# EAGLE design main (EAGLE 7.6.0)
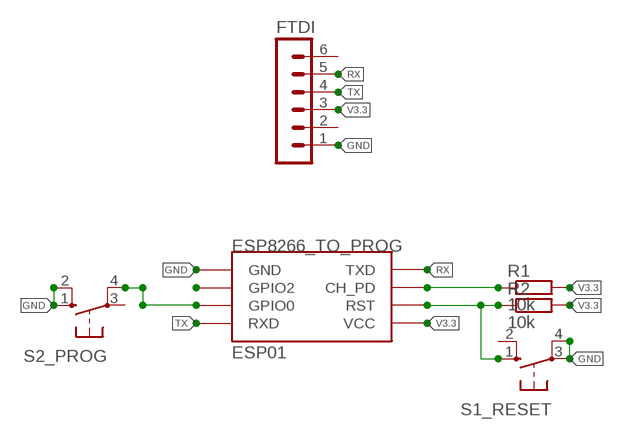
[diagram p0: schematic, sheet 1]

## Parts
ESP8266_TO_PROG  ESP01  [ESP01]
FTDI  MA06-1  [MA06-1]
R1  10k  R-EU_0204/7  [0204/7]
R2  10k  R-EU_0204/7  [0204/7]
S1_RESET  10-XX  [B3F-10XX]
S2_PROG  10-XX  [B3F-10XX]

## Nets
GND: ESP8266_TO_PROG.GND FTDI.1 S1_RESET.3(P) S1_RESET.4(P1) S2_PROG.1(S) S2_PROG.2(S1)
N$2: ESP8266_TO_PROG.GPIO2
N$3: ESP8266_TO_PROG.GPIO0 S2_PROG.4(P1)
N$6: ESP8266_TO_PROG.CH_PD R1.1
N$7: ESP8266_TO_PROG.RST R2.1 S1_RESET.1(S)
RX: ESP8266_TO_PROG.TX(TXD) FTDI.5
TX: ESP8266_TO_PROG.RX(RXD) FTDI.4
V3.3: ESP8266_TO_PROG.VCC FTDI.3 R1.2 R2.2
Unconnected: FTDI.2 FTDI.6 S1_RESET.2(S1) S2_PROG.3(P)

## Library data of the parts
ESP8266_TO_PROG = esp8266modules:ESP01: ESP8266 Wifi module 01
FTDI = con-lstb:MA06-1: PIN HEADER; OC_FARNELL: unknown; OC_NEWARK: unknown
R1 R2 = resistor:R-EU_: RESISTOR, European symbol
S1_RESET S2_PROG = switch-omron:10-XX: OMRON SWITCH; MPN: B3F-1000; OC_FARNELL: 176432; OC_NEWARK: 36M3542

## Board
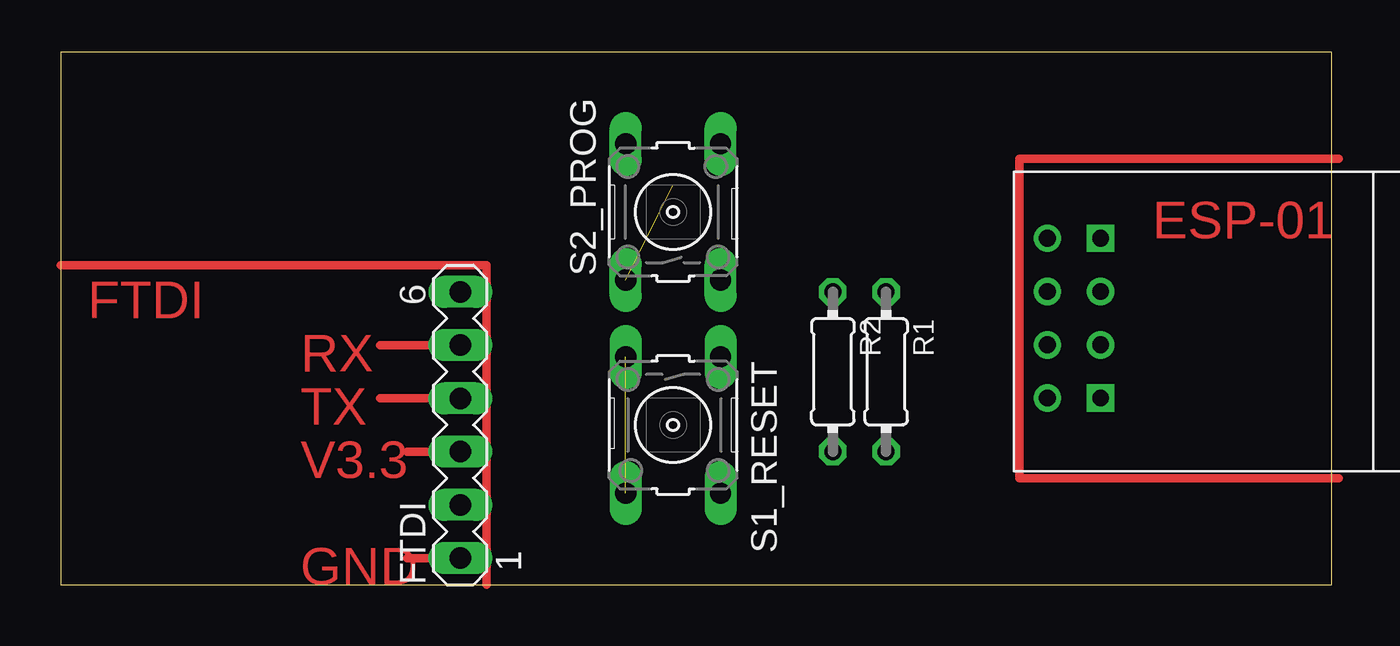
[diagram p1: board, top side]
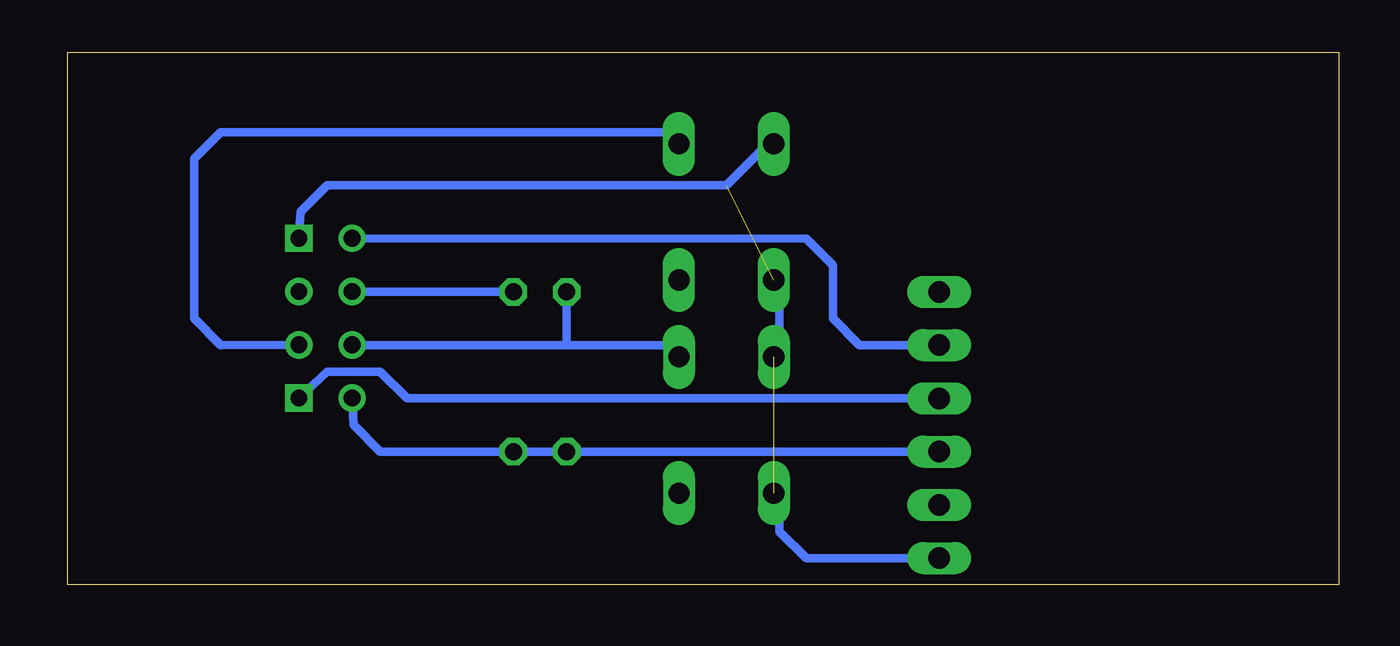
[diagram p2: board, bottom side, seen from below]

Size 60.63 x 25.39 mm. Coordinates in mm from the lower left corner, seen from the top.
Outline: 0,0 60.63,0 60.63,25.39 0,25.39 0,0
Copper layers (1*16): Top 0.035mm / dielectric 1.5mm / Bottom 0.035mm
Design rules "default": minimum track width 10mil, minimum drill 24mil, track to track 8mil, track to pad 8mil, pad to pad 8mil, via to via 8mil, smd to smd 8mil, copper to edge 40mil, drill to drill 8mil, minimum pad ring 10mil, minimum via ring 8mil, stop-mask expansion 4mil, vias tented up to drill 0mil, thermal gap 10mil

### Footprints (pad centres in the part's own frame; a part is rotated, then mirrored left to right if it is on the bottom)
ESP01 = drill 0.8: CH_PD -1.285,-8.178; GPIO0 1.255,-5.638; GPIO2 -1.285,-5.638; RST 1.255,-8.178; TX -3.825,-8.178; VCC 3.795,-8.178 | drill 0.8 square: GND -3.825,-5.638; RX 3.795,-5.638
MA06-1 = drill 1.016 long: 1 -6.35,0; 2 -3.81,0; 3 -1.27,0; 4 1.27,0; 5 3.81,0; 6 6.35,0
0204/7 = drill 0.813 octagon: 1 -3.81,0; 2 3.81,0
B3F-10XX = drill 1.016 long: 1 -3.251,2.261; 2 3.251,2.261; 3 -3.251,-2.261; 4 3.251,-2.261

### Placement (x,y rotation side)
ESP8266_TO_PROG  55.24,12.7 270 top
FTDI  19.05,7.62 90 top
R1  39.37,10.16 270 top
R2  36.83,10.16 270 top
S1_RESET  29.21,7.62 270 top
S2_PROG  29.21,17.78 90 top

### Tracks (layer width: path | path; a pad name or v marks a point on that pad's centre or on a via)
GND  (2 unrouted)
  Bottom 0.406: S2_PROG.2 26.67,21.59 29.21,19.05 48.26,19.05 49.53,17.78 ESP8266_TO_PROG.GND | S1_RESET.3 26.67,11.43 26.67,13.97 S2_PROG.1 | FTDI.1 25.4,1.27 26.67,2.54 26.67,5.08 S1_RESET.4
N$1
  Top 0.406: 0,15.24 20.32,15.24 20.32,0
N$3
  Bottom 0.406: S2_PROG.4 31.47,21.31 31.75,21.59 53.34,21.59 54.61,20.32 54.61,12.7 53.34,11.43 ESP8266_TO_PROG.GPIO0 49.62,11.43
N$4
  Top 0.406: 15.24,11.43 17.78,11.43
N$5
  Top 0.406: 15.24,8.89 17.78,8.89
N$6
  Bottom 0.406: R1.1 47.05,13.97 ESP8266_TO_PROG.CH_PD
N$7
  Bottom 0.406: R2.1 36.83,11.43 | 36.83,11.43 31.75,11.43 31.75,11.15 S1_RESET.1 | 36.83,11.43 47.05,11.43 ESP8266_TO_PROG.RST
N$8
  Top 0.406: 16.51,6.35 17.78,6.35
N$9
  Top 0.406: 17.78,1.27 16.51,1.27
N$10
  Top 0.406: 60.96,20.32 45.72,20.32 45.72,5.08 60.96,5.08
RX
  Bottom 0.406: ESP8266_TO_PROG.TX 25.4,16.51 24.13,15.24 24.13,12.7 22.86,11.43 FTDI.5
TX
  Bottom 0.406: FTDI.4 44.45,8.89 45.72,10.16 48.26,10.16 ESP8266_TO_PROG.RX
V3.3
  Bottom 0.406: FTDI.3 R2.2 R1.2 45.72,6.35 46.99,7.62 ESP8266_TO_PROG.VCC

### Text on the board
Top: ESP-01 | FTDI | RX | TX | V3.3 | GND